# EAGLE design Pendant64-matrix (EAGLE 6.3)
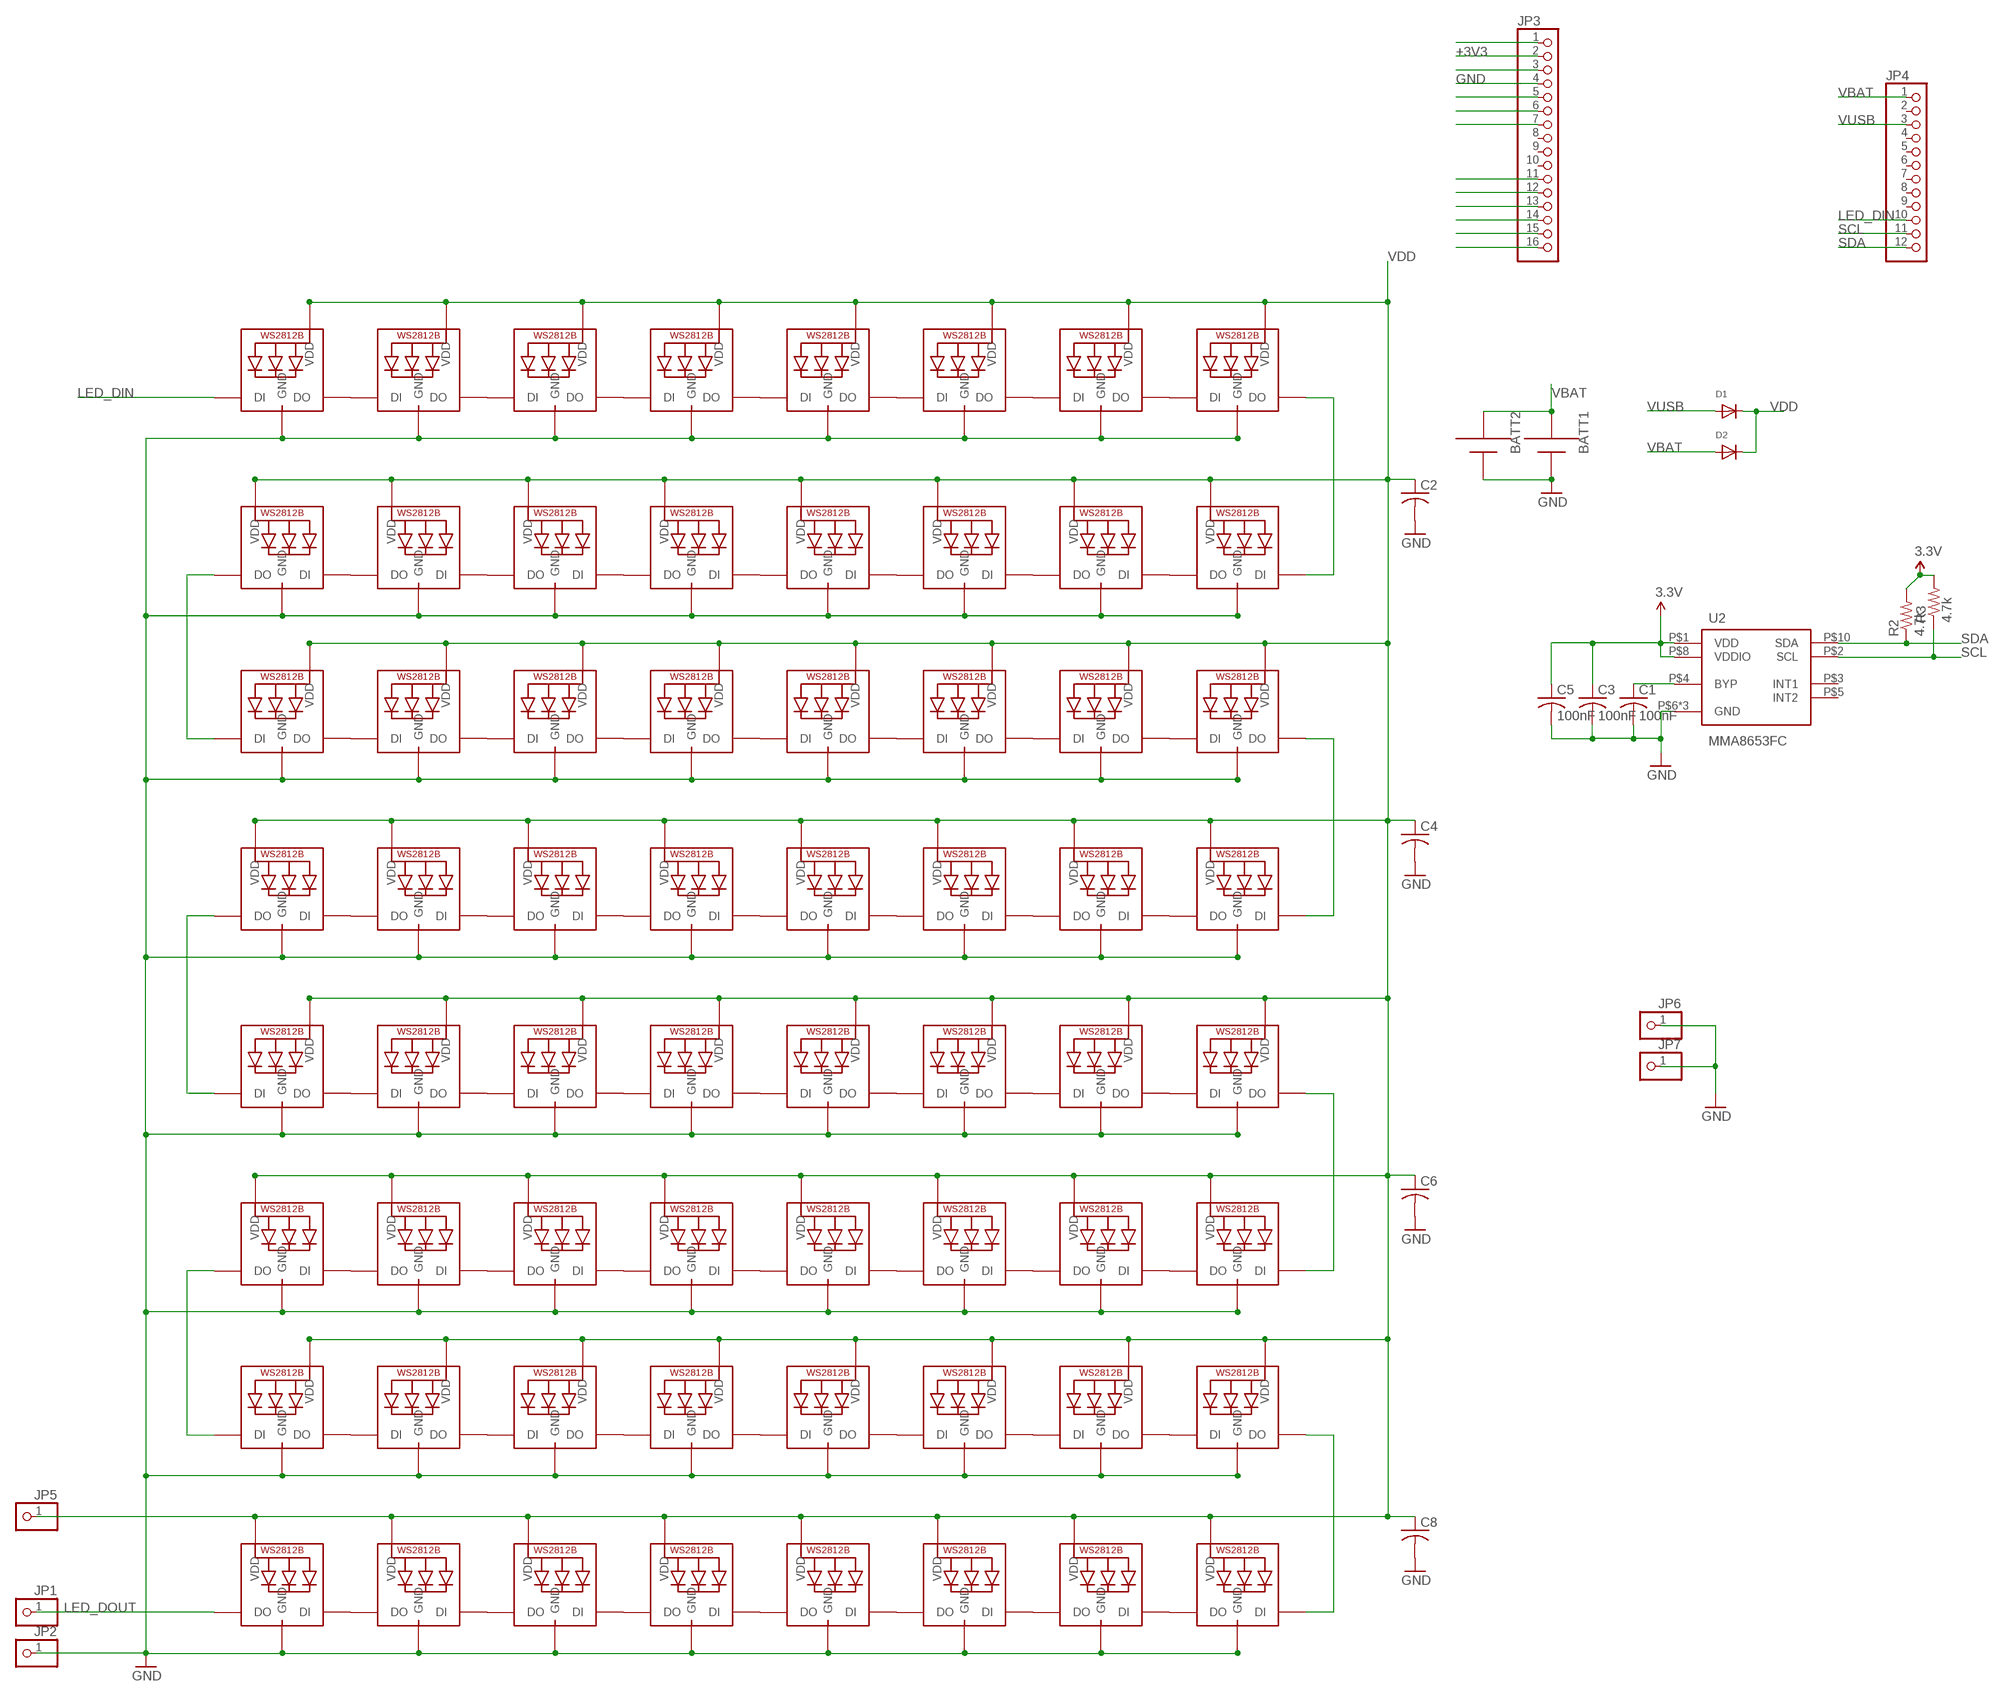
[diagram p0: schematic, sheet 1]

## Parts
BATT1  AAA  [12BH412]
BATT2  AAA  [12BH412]
C1  100nF  C-USC0402  [C0402]
C2  C-USC0402K  [C0402K]
C3  100nF  C-USC0402  [C0402]
C4  C-USC0402K  [C0402K]
C5  100nF  C-USC0402  [C0402]
C6  C-USC0402K  [C0402K]
C8  C-USC0402K  [C0402K]
D1  DIODESOD-123  [SOD-123]
D2  DIODESOD-123  [SOD-123]
JP1  PINHD-1X1  [1X01]
JP2  PINHD-1X1  [1X01]
JP3  PINHD-1X161X16_SMT  [1X16_SMT]
JP4  PINHD-1X121X12_SMT  [1X12_SMT]
JP5  PINHD-1X1  [1X01]
JP6  PINHD-1X1  [1X01]
JP7  PINHD-1X1  [1X01]
LED1  WS2812B3535  [LED3535]
LED2  WS2812B3535  [LED3535]
LED3  WS2812B3535  [LED3535]
LED4  WS2812B3535  [LED3535]
LED5  WS2812B3535  [LED3535]
LED6  WS2812B3535  [LED3535]
LED7  WS2812B3535  [LED3535]
LED8  WS2812B3535  [LED3535]
LED9  WS2812B3535  [LED3535]
LED10  WS2812B3535  [LED3535]
LED11  WS2812B3535  [LED3535]
LED12  WS2812B3535  [LED3535]
LED13  WS2812B3535  [LED3535]
LED14  WS2812B3535  [LED3535]
LED15  WS2812B3535  [LED3535]
LED16  WS2812B3535  [LED3535]
LED17  WS2812B3535  [LED3535]
LED18  WS2812B3535  [LED3535]
LED19  WS2812B3535  [LED3535]
LED20  WS2812B3535  [LED3535]
LED21  WS2812B3535  [LED3535]
LED22  WS2812B3535  [LED3535]
LED23  WS2812B3535  [LED3535]
LED24  WS2812B3535  [LED3535]
LED25  WS2812B3535  [LED3535]
LED26  WS2812B3535  [LED3535]
LED27  WS2812B3535  [LED3535]
LED28  WS2812B3535  [LED3535]
LED29  WS2812B3535  [LED3535]
LED30  WS2812B3535  [LED3535]
LED31  WS2812B3535  [LED3535]
LED32  WS2812B3535  [LED3535]
LED33  WS2812B3535  [LED3535]
LED34  WS2812B3535  [LED3535]
LED35  WS2812B3535  [LED3535]
LED36  WS2812B3535  [LED3535]
LED37  WS2812B3535  [LED3535]
LED38  WS2812B3535  [LED3535]
LED39  WS2812B3535  [LED3535]
LED40  WS2812B3535  [LED3535]
LED41  WS2812B3535  [LED3535]
LED42  WS2812B3535  [LED3535]
LED43  WS2812B3535  [LED3535]
LED44  WS2812B3535  [LED3535]
LED45  WS2812B3535  [LED3535]
LED46  WS2812B3535  [LED3535]
LED47  WS2812B3535  [LED3535]
LED48  WS2812B3535  [LED3535]
LED49  WS2812B3535  [LED3535]
LED50  WS2812B3535  [LED3535]
LED51  WS2812B3535  [LED3535]
LED52  WS2812B3535  [LED3535]
LED53  WS2812B3535  [LED3535]
LED54  WS2812B3535  [LED3535]
LED55  WS2812B3535  [LED3535]
LED56  WS2812B3535  [LED3535]
LED57  WS2812B3535  [LED3535]
LED58  WS2812B3535  [LED3535]
LED59  WS2812B3535  [LED3535]
LED60  WS2812B3535  [LED3535]
LED61  WS2812B3535  [LED3535]
LED62  WS2812B3535  [LED3535]
LED63  WS2812B3535  [LED3535]
LED64  WS2812B3535  [LED3535]
R2  4.7k  R-US_R0402  [R0402]
R3  4.7k  R-US_R0402  [R0402]
U2  MMA8653FC  [VFDFN-10]

## Nets
+3V3: C3.1 C5.1 JP3.2 R2.2 R3.2 U2.P$1(VDD) U2.P$8(VDDIO) ; supply symbol labelled 3.3V
GND: BATT1.+ BATT2.+ C1.2 C2.2 C3.2 C4.2 C5.2 C6.2 C8.2 JP2.1 JP3.4 JP6.1 JP7.1 LED1.4(GND) LED2.4(GND) LED3.4(GND) LED4.4(GND) LED5.4(GND) LED6.4(GND) LED7.4(GND) LED8.4(GND) LED9.4(GND) LED10.4(GND) LED11.4(GND) LED12.4(GND) LED13.4(GND) LED14.4(GND) LED15.4(GND) LED16.4(GND) LED17.4(GND) LED18.4(GND) LED19.4(GND) LED20.4(GND) LED21.4(GND) LED22.4(GND) LED23.4(GND) LED24.4(GND) LED25.4(GND) LED26.4(GND) LED27.4(GND) LED28.4(GND) LED29.4(GND) LED30.4(GND) LED31.4(GND) LED32.4(GND) LED33.4(GND) LED34.4(GND) LED35.4(GND) LED36.4(GND) LED37.4(GND) LED38.4(GND) LED39.4(GND) LED40.4(GND) LED41.4(GND) LED42.4(GND) LED43.4(GND) LED44.4(GND) LED45.4(GND) LED46.4(GND) LED47.4(GND) LED48.4(GND) LED49.4(GND) LED50.4(GND) LED51.4(GND) LED52.4(GND) LED53.4(GND) LED54.4(GND) LED55.4(GND) LED56.4(GND) LED57.4(GND) LED58.4(GND) LED59.4(GND) LED60.4(GND) LED61.4(GND) LED62.4(GND) LED63.4(GND) LED64.4(GND) U2.P$6(GND) U2.P$7(GND) U2.P$9(GND)
LED_DIN: JP4.10 LED1.1(DI)
LED_DOUT: JP1.1 LED64.3(DO)
N$1: LED1.3(DO) LED2.1(DI)
N$2: LED2.3(DO) LED3.1(DI)
N$3: LED3.3(DO) LED4.1(DI)
N$4: LED4.3(DO) LED5.1(DI)
N$5: LED5.3(DO) LED6.1(DI)
N$6: LED6.3(DO) LED7.1(DI)
N$7: LED7.3(DO) LED8.1(DI)
N$8: LED9.3(DO) LED10.1(DI)
N$9: LED10.3(DO) LED11.1(DI)
N$10: LED11.3(DO) LED12.1(DI)
N$11: LED12.3(DO) LED13.1(DI)
N$12: LED13.3(DO) LED14.1(DI)
N$13: LED14.3(DO) LED15.1(DI)
N$14: LED15.3(DO) LED16.1(DI)
N$15: LED17.3(DO) LED18.1(DI)
N$16: LED18.3(DO) LED19.1(DI)
N$17: LED19.3(DO) LED20.1(DI)
N$18: LED20.3(DO) LED21.1(DI)
N$19: LED21.3(DO) LED22.1(DI)
N$20: LED22.3(DO) LED23.1(DI)
N$21: LED23.3(DO) LED24.1(DI)
N$22: LED25.3(DO) LED26.1(DI)
N$23: LED26.3(DO) LED27.1(DI)
N$24: LED27.3(DO) LED28.1(DI)
N$25: LED28.3(DO) LED29.1(DI)
N$26: LED29.3(DO) LED30.1(DI)
N$27: LED30.3(DO) LED31.1(DI)
N$28: LED31.3(DO) LED32.1(DI)
N$29: LED33.3(DO) LED34.1(DI)
N$30: LED34.3(DO) LED35.1(DI)
N$31: JP3.1
N$32: LED8.3(DO) LED9.1(DI)
N$33: LED16.3(DO) LED17.1(DI)
N$34: LED24.3(DO) LED25.1(DI)
N$35: LED32.3(DO) LED33.1(DI)
N$36: LED35.3(DO) LED36.1(DI)
N$37: LED36.3(DO) LED37.1(DI)
N$38: LED37.3(DO) LED38.1(DI)
N$39: LED38.3(DO) LED39.1(DI)
N$40: LED39.3(DO) LED40.1(DI)
N$41: LED41.3(DO) LED42.1(DI)
N$42: LED42.3(DO) LED43.1(DI)
N$43: LED43.3(DO) LED44.1(DI)
N$44: LED44.3(DO) LED45.1(DI)
N$45: LED45.3(DO) LED46.1(DI)
N$46: LED46.3(DO) LED47.1(DI)
N$47: LED47.3(DO) LED48.1(DI)
N$48: LED49.3(DO) LED50.1(DI)
N$49: LED50.3(DO) LED51.1(DI)
N$50: LED51.3(DO) LED52.1(DI)
N$51: LED52.3(DO) LED53.1(DI)
N$52: LED53.3(DO) LED54.1(DI)
N$53: LED54.3(DO) LED55.1(DI)
N$54: LED55.3(DO) LED56.1(DI)
N$55: LED57.3(DO) LED58.1(DI)
N$56: LED58.3(DO) LED59.1(DI)
N$57: LED59.3(DO) LED60.1(DI)
N$58: LED60.3(DO) LED61.1(DI)
N$59: LED61.3(DO) LED62.1(DI)
N$60: LED62.3(DO) LED63.1(DI)
N$61: LED63.3(DO) LED64.1(DI)
N$62: C1.1 U2.P$4(BYP)
N$63: LED40.3(DO) LED41.1(DI)
N$64: LED48.3(DO) LED49.1(DI)
N$65: LED56.3(DO) LED57.1(DI)
N$66: JP3.3
N$68: JP3.5
N$69: JP3.6
N$70: JP3.7
N$74: JP3.11
N$75: JP3.12
N$76: JP3.13
N$77: JP3.14
N$78: JP3.15
N$79: JP3.16
SCL: JP4.11 R3.1 U2.P$2(SCL)
SDA: JP4.12 R2.1 U2.P$10(SDA)
VBAT: BATT1.- BATT2.- D2.A JP4.1
VDD: C2.1 C4.1 C6.1 C8.1 D1.C D2.C JP5.1 LED1.2(VDD) LED2.2(VDD) LED3.2(VDD) LED4.2(VDD) LED5.2(VDD) LED6.2(VDD) LED7.2(VDD) LED8.2(VDD) LED9.2(VDD) LED10.2(VDD) LED11.2(VDD) LED12.2(VDD) LED13.2(VDD) LED14.2(VDD) LED15.2(VDD) LED16.2(VDD) LED17.2(VDD) LED18.2(VDD) LED19.2(VDD) LED20.2(VDD) LED21.2(VDD) LED22.2(VDD) LED23.2(VDD) LED24.2(VDD) LED25.2(VDD) LED26.2(VDD) LED27.2(VDD) LED28.2(VDD) LED29.2(VDD) LED30.2(VDD) LED31.2(VDD) LED32.2(VDD) LED33.2(VDD) LED34.2(VDD) LED35.2(VDD) LED36.2(VDD) LED37.2(VDD) LED38.2(VDD) LED39.2(VDD) LED40.2(VDD) LED41.2(VDD) LED42.2(VDD) LED43.2(VDD) LED44.2(VDD) LED45.2(VDD) LED46.2(VDD) LED47.2(VDD) LED48.2(VDD) LED49.2(VDD) LED50.2(VDD) LED51.2(VDD) LED52.2(VDD) LED53.2(VDD) LED54.2(VDD) LED55.2(VDD) LED56.2(VDD) LED57.2(VDD) LED58.2(VDD) LED59.2(VDD) LED60.2(VDD) LED61.2(VDD) LED62.2(VDD) LED63.2(VDD) LED64.2(VDD)
VUSB: D1.A JP4.3
Unconnected: JP3.8 JP3.9 JP3.10 JP4.2 JP4.4 JP4.5 JP4.6 JP4.7 JP4.8 JP4.9 U2.P$3(INT1) U2.P$5(INT2)

## Library data of the parts
BATT1 BATT2 = adafruit:AAA: AAA PC pin holder Mouser part #12BH412 - but pretty much any 1x AAA battery holder should be the same http://www.ladyada.net/library/pcb/eaglelibrary.html
C1-C6 C8 = adafruit:C-US: CAPACITOR, American symbol
D1 D2 = adafruit:DIODE: Diode SMADIODE - SMA Surface Mount Package 20V 1A Schottky Diode Digikey: 641-1014-6-ND DO-1N4148 - Through Hole Small Current Diode SOD-123 20V 1 A (.5mV Vf) Schottky Diode - Digikey: MBRX120TPMSCT-ND SOD-323 10V 570mA (.38mV Vf, 3ns) Schottky Diode - Digikey: ZLLS410CT-ND SOD-523 30V 30mA Schottky Diode (RB751S-40TE61) - Digikey: RB751S-40TE61CT-ND SOT23-R/W - SOT23 Package (R = Solder Paste/Reflow Ovens, W = Hand-Soldering) BAT54Film 40V 300mA - Digikey: 497-7162-1-ND
JP1 JP2 JP5-JP7 = adafruit:PINHD-1X1: Pin header 1x1 for 0.1" spacing With round pins
JP3 = pinhead+:PINHD-1X16: PIN HEADER
JP4 = pinhead+:PINHD-1X12: PIN HEADER
LED1-LED64 = adafruit:WS2812B
R2 R3 = adafruit:R-US_: RESISTOR, American symbol
U2 = teensy_adapter:MMA8653FC

## Net classes
0 default: width 0.127 mm, drill 0.35 mm
1 power: width 0.254 mm, drill 0.35 mm

## Board
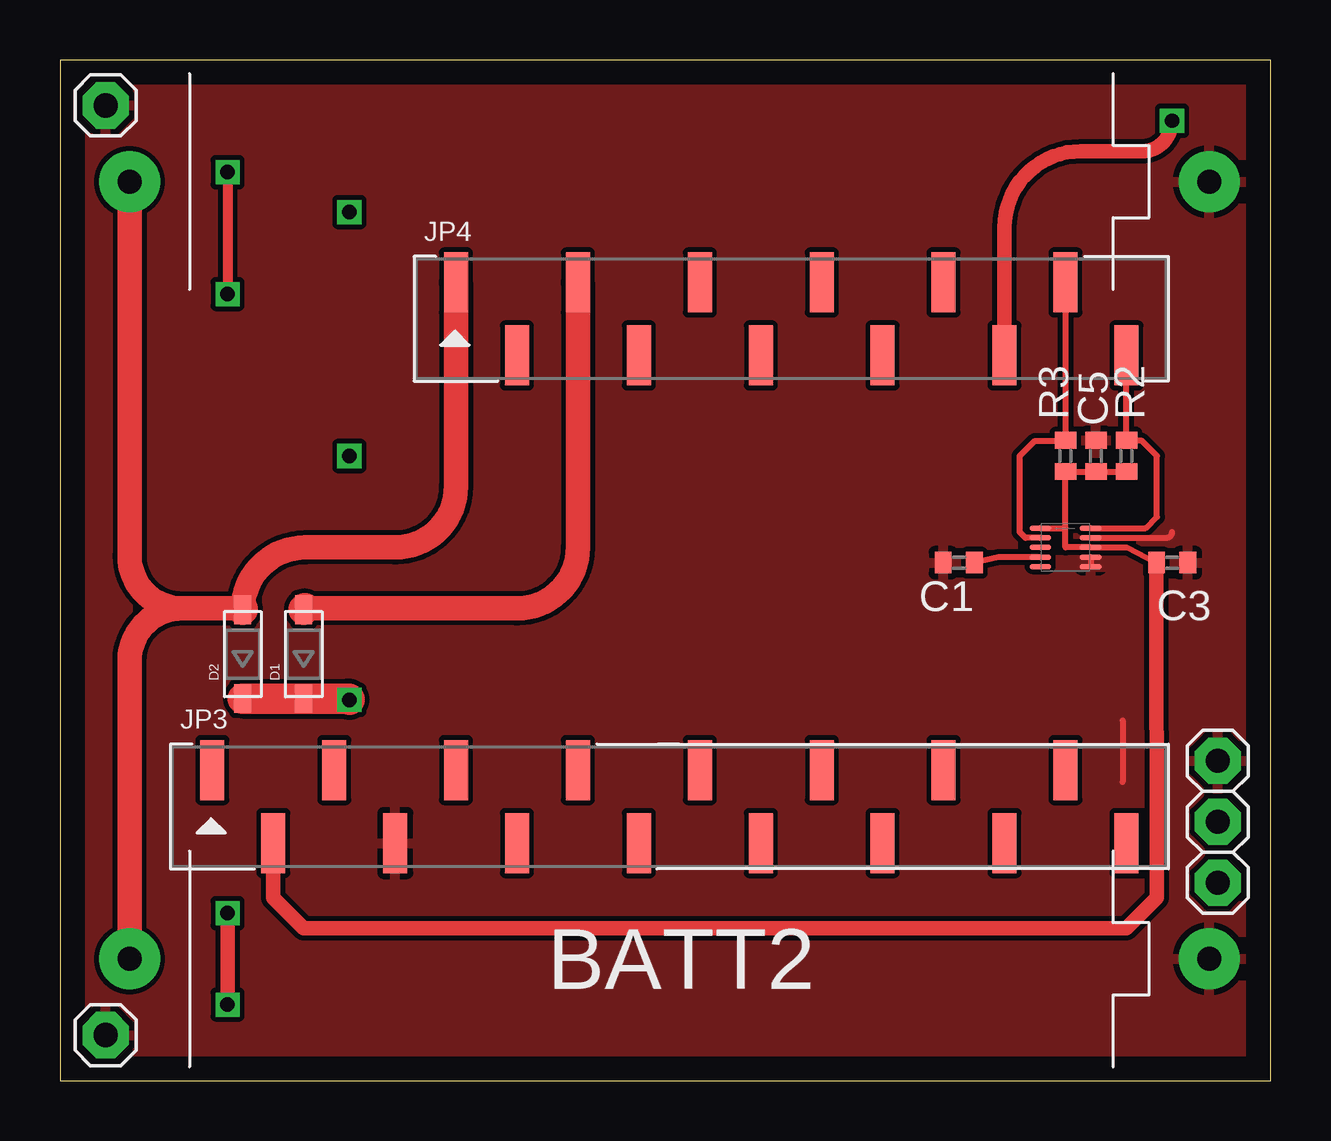
[diagram p1: board, top side]
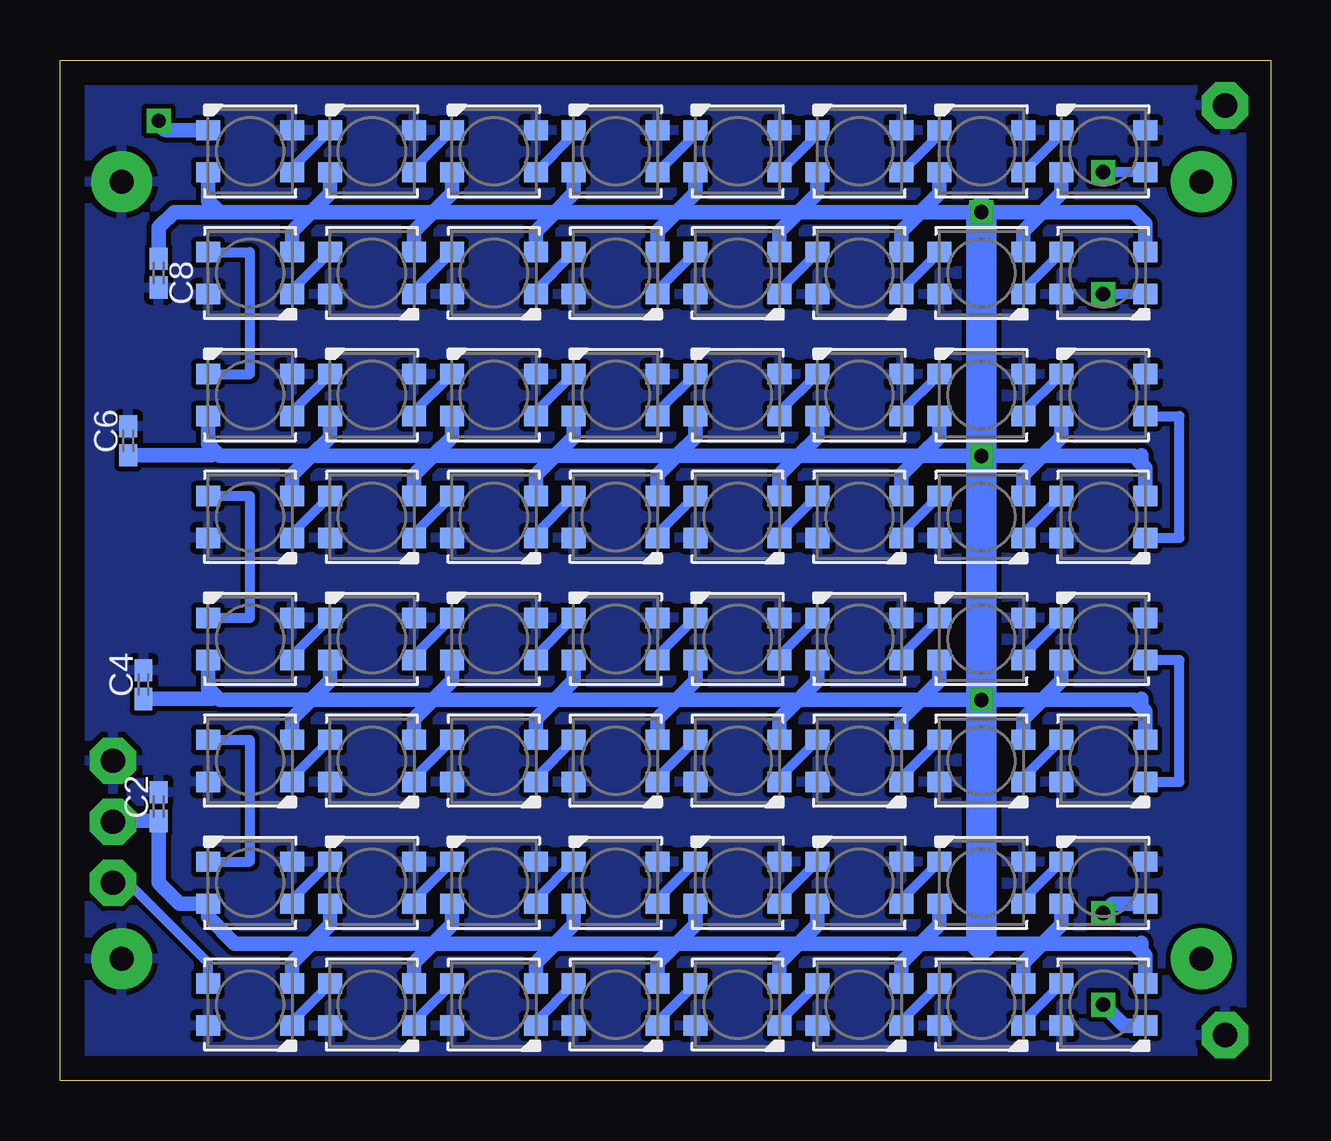
[diagram p2: board, bottom side, seen from below]

Size 50.47 x 42.53 mm. Coordinates in mm from the lower left corner, seen from the top.
Outline: 0,0 50.47,0 50.47,42.53 0,42.53 0,0
Copper layers (1*16): Top 0.035mm / dielectric 1.5mm / Bottom 0.035mm
Design rules "default": minimum track width 10mil, minimum drill 24mil, track to track 8mil, track to pad 8mil, pad to pad 8mil, via to via 8mil, smd to smd 8mil, copper to edge 40mil, drill to drill 8mil, minimum pad ring 10mil, minimum via ring 8mil, stop-mask expansion 4mil, vias tented up to drill 0mil, thermal gap 10mil

### Footprints (pad centres in the part's own frame; a part is rotated, then mirrored left to right if it is on the bottom)
12BH412 = drill 1 pad 2.54: + 22.5,0; - -22.5,0
C0402 = smd 0.7 x 0.9: 1 -0.65,0; 2 0.65,0
C0402K = smd 0.925 x 0.74: 1 -0.6,0; 2 0.6,0
SOD-123 = smd 1.2 x 0.7: A 1.85,0; C -1.85,0
1X01 = drill 1.016 pad 1.93 octagon: 1 0,0
1X16_SMT = smd 1 x 2.5: 1 -19.05,1.52; 2 -16.51,-1.52; 3 -13.97,1.52; 4 -11.43,-1.52; 5 -8.89,1.52; 6 -6.35,-1.52; 7 -3.81,1.52; 8 -1.27,-1.52; 9 1.27,1.52; 10 3.81,-1.52; 11 6.35,1.52; 12 8.89,-1.52; 13 11.43,1.52; 14 13.97,-1.52; 15 16.51,1.52; 16 19.05,-1.52
1X12_SMT = smd 1 x 2.5: 1 -13.97,1.52; 2 -11.43,-1.52; 3 -8.89,1.52; 4 -6.35,-1.52; 5 -3.81,1.52; 6 -1.27,-1.52; 7 1.27,1.52; 8 3.81,-1.52; 9 6.35,1.52; 10 8.89,-1.52; 11 11.43,1.52; 12 13.97,-1.52
LED3535 = smd 1 x 0.85: 1 -1.75,0.875; 2 -1.75,-0.875; 3 1.75,-0.875; 4 1.75,0.875
R0402 = smd 0.7 x 0.9: 1 -0.65,0; 2 0.65,0
VFDFN-10 = smd 0.9 x 0.225: P$1 -1.05,0.8; P$2 -1.05,0.4; P$3 -1.05,0; P$4 -1.05,-0.4; P$5 -1.05,-0.8; P$6 1.05,-0.8; P$7 1.05,-0.4; P$8 1.05,0; P$9 1.05,0.4; P$10 1.05,0.8

### Placement (x,y rotation side)
BATT1  25.4,37.47 0 top
BATT2  25.4,5.08 0 top
C1  37.47,21.59 180 top
C2  46.35,11.43 90 bottom
C3  46.35,21.59 0 top
C4  46.99,16.51 90 bottom
C5  43.18,26.04 90 top
C6  47.62,26.67 90 bottom
C8  46.35,33.66 270 bottom
D1  10.16,17.78 90 top
D2  7.62,17.78 90 top
JP1  48.26,8.26 0 top
JP2  48.26,13.34 0 top
JP3  25.4,11.43 0 top
JP4  30.48,31.75 0 top
JP5  48.26,10.79 0 top
JP6  1.91,1.91 0 top
JP7  1.91,40.64 0 top
LED1  42.55,38.73 0 bottom
LED2  37.47,38.73 0 bottom
LED3  32.38,38.73 0 bottom
LED4  27.3,38.73 0 bottom
LED5  22.23,38.73 0 bottom
LED6  17.14,38.73 0 bottom
LED7  12.06,38.73 0 bottom
LED8  6.99,38.73 0 bottom
LED9  6.99,33.66 180 bottom
LED10  12.06,33.66 180 bottom
LED11  17.14,33.66 180 bottom
LED12  22.23,33.66 180 bottom
LED13  27.3,33.66 180 bottom
LED14  32.38,33.66 180 bottom
LED15  37.47,33.66 180 bottom
LED16  42.55,33.66 180 bottom
LED17  42.55,28.57 0 bottom
LED18  37.47,28.57 0 bottom
LED19  32.38,28.57 0 bottom
LED20  27.3,28.57 0 bottom
LED21  22.23,28.57 0 bottom
LED22  17.14,28.57 0 bottom
LED23  12.06,28.57 0 bottom
LED24  6.99,28.57 0 bottom
LED25  6.99,23.5 180 bottom
LED26  12.06,23.5 180 bottom
LED27  17.14,23.5 180 bottom
LED28  22.23,23.5 180 bottom
LED29  27.3,23.5 180 bottom
LED30  32.38,23.5 180 bottom
LED31  37.47,23.5 180 bottom
LED32  42.55,23.5 180 bottom
LED33  42.55,18.41 0 bottom
LED34  37.47,18.41 0 bottom
LED35  32.38,18.41 0 bottom
LED36  27.3,18.41 0 bottom
LED37  22.23,18.41 0 bottom
LED38  17.14,18.41 0 bottom
LED39  12.06,18.41 0 bottom
LED40  6.99,18.41 0 bottom
LED41  6.99,13.34 180 bottom
LED42  12.06,13.34 180 bottom
LED43  17.14,13.34 180 bottom
LED44  22.23,13.34 180 bottom
LED45  27.3,13.34 180 bottom
LED46  32.38,13.34 180 bottom
LED47  37.47,13.34 180 bottom
LED48  42.55,13.34 180 bottom
LED49  42.55,8.26 0 bottom
LED50  37.47,8.26 0 bottom
LED51  32.38,8.26 0 bottom
LED52  27.3,8.26 0 bottom
LED53  22.23,8.26 0 bottom
LED54  17.14,8.26 0 bottom
LED55  12.06,8.26 0 bottom
LED56  6.99,8.26 0 bottom
LED57  6.99,3.17 180 bottom
LED58  12.06,3.17 180 bottom
LED59  17.14,3.17 180 bottom
LED60  22.23,3.17 180 bottom
LED61  27.3,3.17 180 bottom
LED62  32.38,3.17 180 bottom
LED63  37.47,3.17 180 bottom
LED64  42.55,3.17 180 bottom
R2  44.45,26.04 270 top
R3  41.91,26.04 270 top
U2  41.91,22.23 0 top

### Tracks (layer width: path | path; a pad name or v marks a point on that pad's centre or on a via)
+3V3
  Top 0.254: R2.2 C5.1 R3.2 41.91,23.02 | 41.91,23.02 41.91,22.23 U2.P$8 44.47,22.23 C3.1 | U2.P$1 41.91,23.02
  Top 0.61: JP3.2 8.89,7.62 10.16,6.35 44.45,6.35 45.72,7.62 C3.1
GND
  Top 0.254: 44.3,15.01 LED48.4 | U2.P$7 U2.P$6 | U2.P$9 46.12,22.62 arc90 46.35,22.86
  pour Top: -2.54,44.45 52.07,44.45 52.07,-1.27 -2.54,-1.27
  pour Bottom: -2.54,44.45 52.07,44.45 52.07,-1.27 -2.54,-1.27
LED_DIN  (via drill 0.6)
  Top 0.61: JP4.10 39.37,35.56 arc-90 42.55,38.73 45.09,38.73 arc90 v46.35,40.01
  Bottom 0.61: LED1.1 45.96,39.61 arc90 v46.35,40.01
LED_DOUT
  Bottom 0.406: LED64.3 44.3,4.92 47.62,8.26 JP1.1
N$1
  Bottom 0.406: LED1.3 40.8,38.03 LED2.1
N$2
  Bottom 0.406: LED2.3 35.72,38.03 LED3.1
N$3
  Bottom 0.406: LED4.1 29.05,39.44 LED3.3
N$4
  Bottom 0.406: LED5.1 23.98,39.44 LED4.3
N$5
  Bottom 0.406: LED6.1 18.89,39.44 LED5.3
N$6
  Bottom 0.406: LED7.1 13.81,39.44 LED6.3
N$7
  Bottom 0.406: LED8.1 8.73,39.44 LED7.3
N$8
  Bottom 0.406: LED10.1 10.31,32.95 LED9.3
N$9
  Bottom 0.406: LED11.1 15.39,32.95 LED10.3
N$10
  Bottom 0.406: LED12.1 20.48,32.95 LED11.3
N$11
  Bottom 0.406: LED13.1 25.55,32.95 LED12.3
N$12
  Bottom 0.406: LED14.1 30.64,32.95 LED13.3
N$13
  Bottom 0.406: LED15.1 35.72,32.95 LED14.3
N$14
  Bottom 0.406: LED16.1 40.8,32.95 LED15.3
N$15
  Bottom 0.406: LED17.3 40.8,27.87 LED18.1
N$16
  Bottom 0.406: LED18.3 35.72,27.87 LED19.1
N$17
  Bottom 0.406: LED19.3 30.64,27.87 LED20.1
N$18
  Bottom 0.406: LED20.3 25.55,27.87 LED21.1
N$19
  Bottom 0.406: LED21.3 20.48,27.87 LED22.1
N$20
  Bottom 0.406: LED22.3 15.39,27.87 LED23.1
N$21
  Bottom 0.406: LED23.3 10.31,27.87 LED24.1
N$22
  Bottom 0.406: LED26.1 10.31,22.79 LED25.3
N$23
  Bottom 0.406: LED27.1 15.39,22.79 LED26.3
N$24
  Bottom 0.406: LED28.1 20.48,22.79 LED27.3
N$25
  Bottom 0.406: LED29.1 25.55,22.79 LED28.3
N$26
  Bottom 0.406: LED30.1 30.64,22.79 LED29.3
N$27
  Bottom 0.406: LED31.1 35.72,22.79 LED30.3
N$28
  Bottom 0.406: LED32.1 40.8,22.79 LED31.3
N$29
  Bottom 0.406: LED33.3 40.8,17.71 LED34.1
N$30
  Bottom 0.406: LED34.3 35.72,17.71 LED35.1
N$32  (via drill 0.6)
  Top 0.406: v6.99,37.86 v6.99,32.78
  Bottom 0.406: LED9.1 v6.99,32.78 | LED8.3 v6.99,37.86
N$33
  Bottom 0.406: LED17.1 42.55,29.45 42.55,34.53 LED16.3
N$34
  Bottom 0.406: LED25.1 3.81,22.62 3.81,27.7 LED24.3
N$35
  Bottom 0.406: LED33.1 42.55,19.29 42.55,24.37 LED32.3
N$36
  Bottom 0.406: LED35.3 30.64,17.71 LED36.1
N$37
  Bottom 0.406: LED36.3 25.55,17.71 LED37.1
N$38
  Bottom 0.406: LED37.3 20.48,17.71 LED38.1
N$39
  Bottom 0.406: LED38.3 15.39,17.71 LED39.1
N$40
  Bottom 0.406: LED39.3 10.31,17.71 LED40.1
N$41
  Bottom 0.406: LED42.1 10.31,12.63 LED41.3
N$42
  Bottom 0.406: LED43.1 15.39,12.63 LED42.3
N$43
  Bottom 0.406: LED44.1 20.48,12.63 LED43.3
N$44
  Bottom 0.406: LED45.1 25.55,12.63 LED44.3
N$45
  Bottom 0.406: LED46.1 30.64,12.63 LED45.3
N$46
  Bottom 0.406: LED47.1 35.72,12.63 LED46.3
N$47
  Bottom 0.406: LED48.1 40.8,12.63 LED47.3
N$48
  Bottom 0.406: LED49.3 40.8,7.55 LED50.1
N$49
  Bottom 0.406: LED50.3 35.72,7.55 LED51.1
N$50
  Bottom 0.406: LED51.3 30.64,7.55 LED52.1
N$51
  Bottom 0.406: LED52.3 25.55,7.55 LED53.1
N$52
  Bottom 0.406: LED53.3 20.48,7.55 LED54.1
N$53
  Bottom 0.406: LED54.3 15.39,7.55 LED55.1
N$54
  Bottom 0.406: LED55.3 10.31,7.55 LED56.1
N$55
  Bottom 0.406: LED58.1 10.31,2.47 LED57.3
N$56
  Bottom 0.406: LED59.1 15.39,2.47 LED58.3
N$57
  Bottom 0.406: LED60.1 20.48,2.47 LED59.3
N$58
  Bottom 0.406: LED61.1 25.55,2.47 LED60.3
N$59
  Bottom 0.406: LED62.1 30.64,2.47 LED61.3
N$60
  Bottom 0.406: LED63.1 35.72,2.47 LED62.3
N$61
  Bottom 0.406: LED64.1 40.8,2.47 LED63.3
N$62
  Top 0.254: U2.P$4 39.12,21.82 C1.1
N$63
  Bottom 0.406: LED41.1 3.81,12.46 3.81,17.54 LED40.3
N$64
  Bottom 0.406: LED49.1 42.55,9.13 42.55,14.21 LED48.3
N$65  (via drill 0.6)
  Top 0.61: v6.99,3.17 v6.99,6.99
  Bottom 0.61: LED57.1 6.11,2.3 v6.99,3.17 | LED56.3 6.59,7.38 v6.99,6.99
SCL
  Top 0.254: JP4.11 R3.1 41.9,26.67 40.64,26.67 40.01,26.04 40.01,22.86 40.24,22.62 U2.P$2
SDA
  Top 0.254: JP4.12 R2.1 45.07,26.68 45.72,26.04 45.72,23.5 45.25,23.02 U2.P$10
VBAT
  Top 1.016: BATT1.- 2.9,21.86 arc90 5.08,19.68 | 5.08,19.68 7.57,19.68 | JP4.1 16.51,24.77 arc-90 13.97,22.23 10.21,22.23 arc90 D2.A | BATT2.- 2.9,17.5 arc-90 5.08,19.68
  Top 1.27: 7.57,19.68 arc-90 D2.A
VDD  (via drill 0.6)
  Top 1.27: D2.C D1.C 12.01,15.93 arc-90 v12.06,15.88
  Bottom 0.61: 44.13,16.19 44.3,16.36 LED33.2 | 44.13,16.19 43.81,15.88 40.01,15.88 | 40.01,15.88 34.92,15.88 | 34.92,15.88 29.84,15.88 | 29.84,15.88 24.77,15.88 | 24.77,15.88 19.68,15.88 | 19.68,15.88 14.61,15.88 | 14.61,15.88 v12.06,15.88 9.53,15.88 | 9.53,15.88 5.71,15.88 5.4,15.56 | 5.4,15.56 5.24,15.39 LED41.2 | 9.53,15.88 10.31,15.09 LED42.2 | 14.61,15.88 15.39,15.09 LED43.2 | 19.68,15.88 20.48,15.09 LED44.2 | 24.77,15.88 25.55,15.09 LED45.2 | 29.84,15.88 30.64,15.09 LED46.2 | 34.92,15.88 35.72,15.09 LED47.2 | 40.01,15.88 40.8,15.09 LED48.2 | 40.01,5.71 34.92,5.71 | 34.92,5.71 29.84,5.71 | 29.84,5.71 24.77,5.71 | 24.77,5.71 19.68,5.71 | 19.68,5.71 14.61,5.71 | 14.61,5.71 12.06,5.71 9.53,5.71 | 9.53,5.71 5.71,5.71 5.4,5.4 | 5.4,5.4 5.24,5.24 LED57.2 | 9.53,5.71 10.31,4.92 LED58.2 | 14.61,5.71 15.39,4.92 LED59.2 | 19.68,5.71 20.48,4.92 LED60.2 | 24.77,5.71 25.55,4.92 LED61.2 | 29.84,5.71 30.64,4.92 LED62.2 | 34.92,5.71 35.72,4.92 LED63.2 | 40.01,5.71 40.8,4.92 LED64.2 | 40.01,5.71 39.22,6.5 LED50.2 | 9.53,5.71 8.73,6.5 LED56.2 | 14.61,5.71 13.81,6.5 LED55.2 | 19.68,5.71 18.89,6.5 LED54.2 | 24.77,5.71 23.98,6.5 LED53.2 | 29.84,5.71 29.05,6.5 LED52.2 | 34.92,5.71 34.13,6.5 LED51.2 | 9.53,15.88 8.73,16.66 LED40.2 | 14.61,15.88 13.81,16.66 LED39.2 | 19.68,15.88 18.89,16.66 LED38.2 | 24.77,15.88 23.98,16.66 LED37.2 | 29.84,15.88 29.05,16.66 LED36.2 | 34.92,15.88 34.13,16.66 LED35.2 | 40.01,15.88 39.22,16.66 LED34.2 | LED17.2 44.3,26.52 44.13,26.35 | 44.13,26.35 43.81,26.04 40.01,26.04 | 40.01,26.04 34.92,26.04 | 34.92,26.04 29.84,26.04 | 29.84,26.04 24.77,26.04 | 24.77,26.04 19.68,26.04 | 19.68,26.04 14.61,26.04 | 14.61,26.04 v12.06,26.04 9.53,26.04
  Bottom 0.61: 9.53,26.04 5.71,26.04 5.4,25.72 | LED25.2 5.24,25.55 5.4,25.72 | LED24.2 8.73,26.82 9.53,26.04 | LED26.2 10.31,25.25 9.53,26.04 | LED23.2 13.81,26.82 14.61,26.04 | LED27.2 15.39,25.25 14.61,26.04 | LED22.2 18.89,26.82 19.68,26.04 | LED28.2 20.48,25.25 19.68,26.04 | LED21.2 23.98,26.82 24.77,26.04 | LED29.2 25.55,25.25 24.77,26.04 | LED20.2 29.05,26.82 29.84,26.04 | LED30.2 30.64,25.25 29.84,26.04 | LED19.2 34.13,26.82 34.92,26.04 | LED31.2 35.72,25.25 34.92,26.04 | LED18.2 39.22,26.82 40.01,26.04 | LED32.2 40.8,25.25 40.01,26.04 | LED1.2 44.3,36.67 43.81,36.2 | 43.81,36.2 40.01,36.2 | 40.01,36.2 34.92,36.2 | 34.92,36.2 29.84,36.2 | 29.84,36.2 24.77,36.2 | 24.77,36.2 19.68,36.2 | 19.68,36.2 14.61,36.2 | 14.61,36.2 v12.06,36.2 9.53,36.2 | 9.53,36.2 5.71,36.2 5.24,35.72 LED9.2 | LED8.2 8.73,36.98 9.53,36.2 | LED10.2 10.31,35.41 9.53,36.2 | LED7.2 13.81,36.98 14.61,36.2 | LED11.2 15.39,35.41 14.61,36.2 | LED6.2 18.89,36.98 19.68,36.2 | LED12.2 20.48,35.41 19.68,36.2 | LED5.2 23.98,36.98 24.77,36.2 | LED13.2 25.55,35.41 24.77,36.2 | LED4.2 29.05,36.98 29.84,36.2 | LED14.2 30.64,35.41 29.84,36.2 | LED3.2 34.13,36.98 34.92,36.2 | LED15.2 35.72,35.41 34.92,36.2 | LED2.2 39.22,36.98 40.01,36.2 | LED16.2 40.8,35.41 40.01,36.2 | 5.4,5.75 5.4,5.4 | 5.4,15.91 5.4,15.56 | 5.4,26.07 5.4,25.72 | C4.1 44.13,15.91 44.13,16.19 | C6.1 44.13,26.07 44.13,26.35 | 40.01,5.71 43.18,5.71 44.3,6.83 LED49.2 45.48,7.38 46.35,8.26 C2.1 48.23,10.83 JP5.1 | C8.1 46.35,35.56 45.72,36.2 43.81,36.2
  Bottom 1.27: v12.06,36.2 v12.06,26.04 v12.06,15.88 12.06,5.71
VUSB
  Top 1.016: JP4.3 21.59,22.23 arc-90 19.05,19.68 10.21,19.68
  Top 1.27: 10.21,19.68 arc90 D1.A